# EAGLE schematic schematic_v1 (EAGLE 9.6.2)
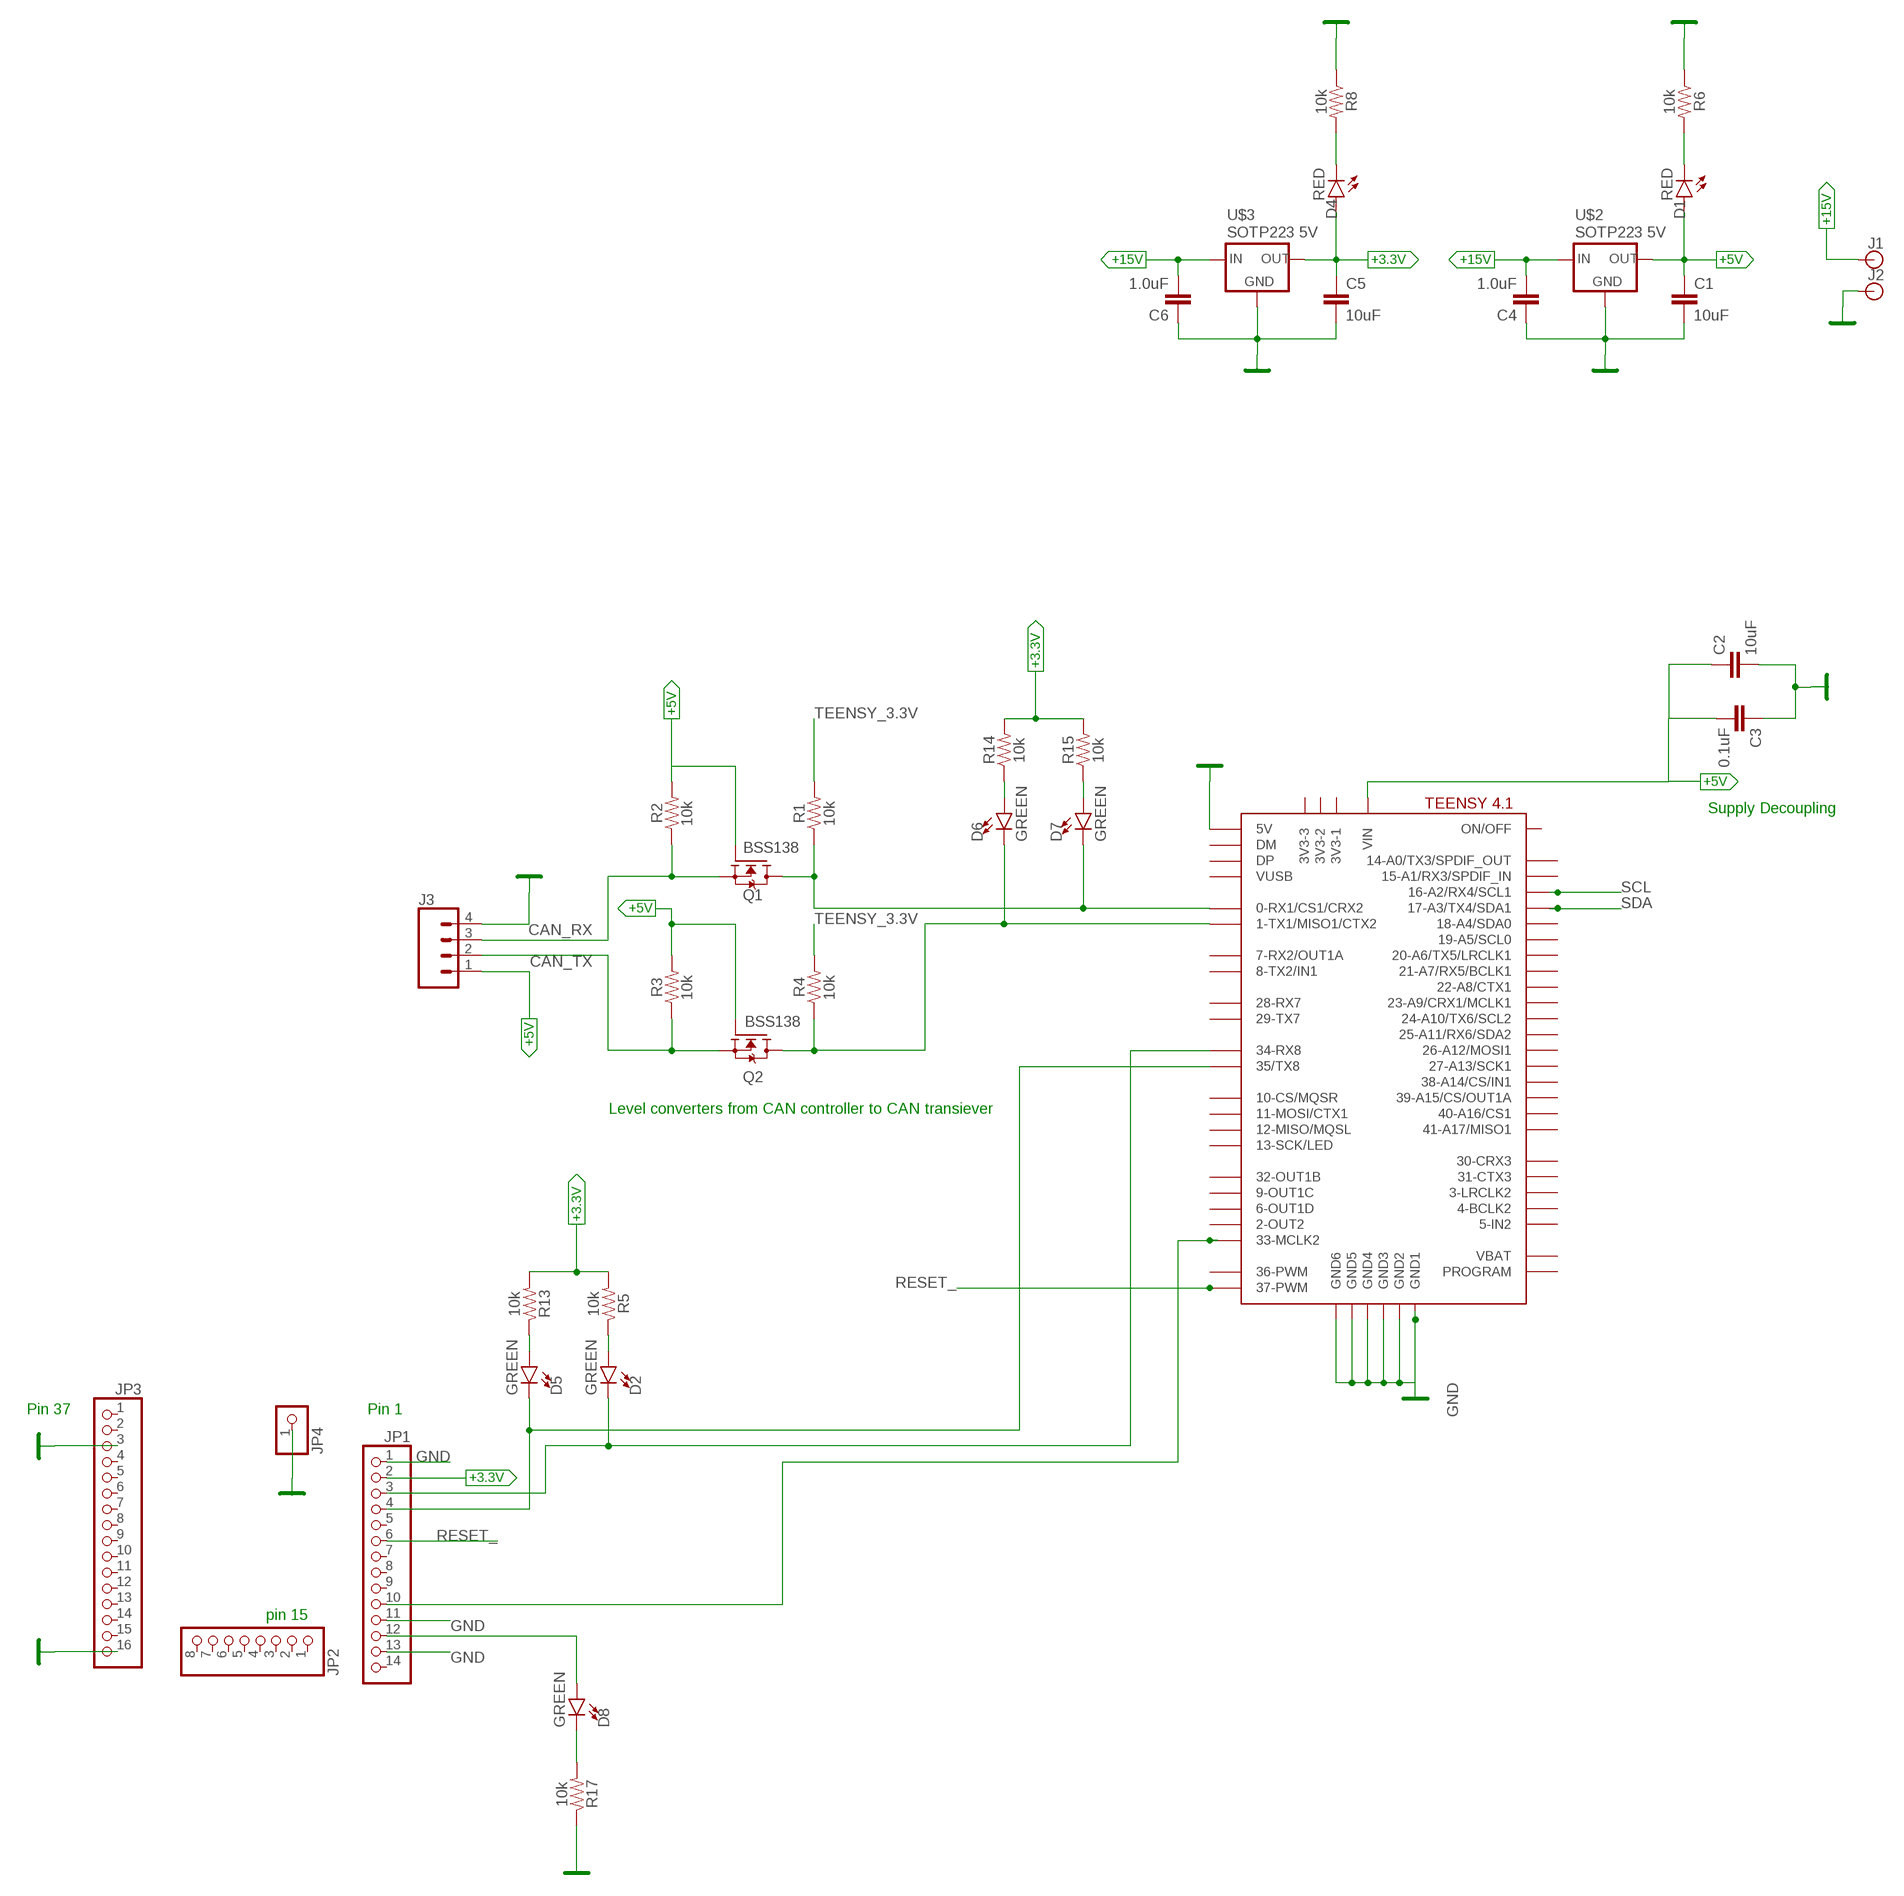
[diagram p0: schematic, sheet 1, part 1 of 2]
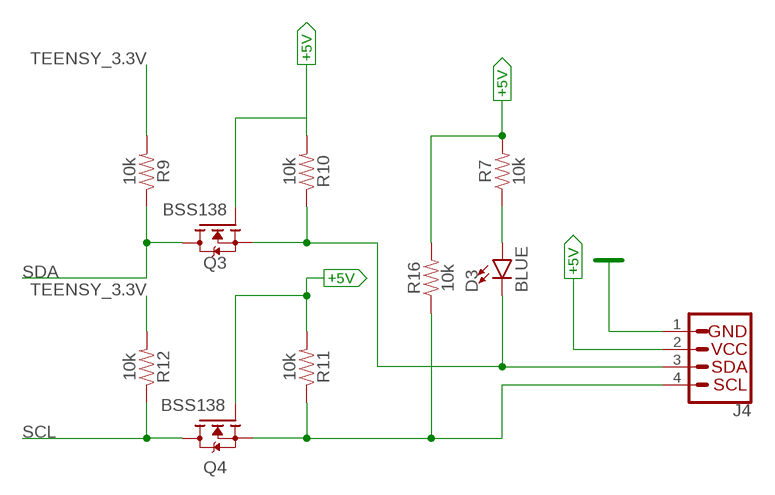
[diagram p1: schematic, sheet 1, part 2 of 2]

## Parts
C1  10uF  10UF-0603-6.3V-20%  [0603]
C2  10uF  10UF-0603-6.3V-20%  [0603]
C3  0.1uF  0.1UF-0603-25V-(+80/-20%)  [0603]
C4  1.0uF  1.0UF-0603-16V-10%  [0603]
C5  10uF  10UF-0603-6.3V-20%  [0603]
C6  1.0uF  1.0UF-0603-16V-10%  [0603]
D1  RED  LED-RED0603  [LED-0603]
D2  GREEN  LED-GREEN0603  [LED-0603]
D3  BLUE  LED-BLUE0603  [LED-0603]
D4  RED  LED-RED0603  [LED-0603]
D5  GREEN  LED-GREEN0603  [LED-0603]
D6  GREEN  LED-GREEN0603  [LED-0603]
D7  GREEN  LED-GREEN0603  [LED-0603]
D8  GREEN  LED-GREEN0603  [LED-0603]
J1  BANANA_CONN  [BANANA_CONN]
J2  BANANA_CONN  [BANANA_CONN]
J3  CONN_04PTH  [1X04]
J4  I2C_STANDARD  [1X04]
JP1  PINHD-1X14  [1X14]
JP2  PINHD-1X8  [1X08]
JP3  PINHD-1X16  [1X16]
JP4  PINHD-1X1  [1X01]
Q1  BSS138  [SOT95P240X111-3N]
Q2  BSS138  [SOT95P240X111-3N]
Q3  BSS138  [SOT95P240X111-3N]
Q4  BSS138  [SOT95P240X111-3N]
R1  10k  10KOHM-0603-1/10W-1%  [0603]
R2  10k  10KOHM-0603-1/10W-1%  [0603]
R3  10k  10KOHM-0603-1/10W-1%  [0603]
R4  10k  10KOHM-0603-1/10W-1%  [0603]
R5  10k  10KOHM-0603-1/10W-1%  [0603]
R6  10k  10KOHM-0603-1/10W-1%  [0603]
R7  10k  10KOHM-0603-1/10W-1%  [0603]
R8  10k  10KOHM-0603-1/10W-1%  [0603]
R9  10k  10KOHM-0603-1/10W-1%  [0603]
R10  10k  10KOHM-0603-1/10W-1%  [0603]
R11  10k  10KOHM-0603-1/10W-1%  [0603]
R12  10k  10KOHM-0603-1/10W-1%  [0603]
R13  10k  10KOHM-0603-1/10W-1%  [0603]
R14  10k  10KOHM-0603-1/10W-1%  [0603]
R15  10k  10KOHM-0603-1/10W-1%  [0603]
R16  10k  10KOHM-0603-1/10W-1%  [0603]
R17  10k  10KOHM-0603-1/10W-1%  [0603]
U$2  SOTP223 5V  V_REG_LD1117VXXLD1117-SMD  [SOT223]
U$3  SOTP223 5V  V_REG_LD1117VXXLD1117-SMD  [SOT223]
U$4  TEENSY41-E  [TENNSY41-E]

## Nets
+3.3V: C5.1 JP1.2 R5.2 R13.2 R14.2 R15.2 U$3.2(OUT)
+5V: C1.1 C2.1 C3.2 D1.A J3.1 J4.2 Q1.1(G) Q2.1(G) Q3.1(G) Q4.1(G) R2.2 R3.2 R7.2 R10.2 R11.2 R16.2 U$2.2(OUT) U$4.VIN
+5V1: D4.A
+15V: C4.2 C6.2 J1.P$1 U$2.3(IN) U$3.3(IN)
CAN_RX: J3.3 Q1.2(S) R2.1
CAN_RX1: D3.C J4.3 Q3.2(S) R10.1
CAN_TX: J3.2 Q2.2(S) R3.1
CAN_TX1: J4.4 Q4.2(S) R11.1 R16.1
GND: C1.2 C2.2 C3.1 C4.1 C5.2 C6.1 J2.P$1 J3.4 J4.1 JP1.1 JP1.11 JP1.13 JP3.3 JP3.16 JP4.1 R6.1 R8.1 R17.1 U$2.1(GND) U$3.1(GND) U$4.+5V(5V) U$4.GND1 U$4.GND2 U$4.GND3 U$4.GND4 U$4.GND5 U$4.GND6
N$1: D5.C JP1.4 U$4.35-TX8(35/TX8)
N$2: D2.C JP1.3 U$4.34-RX8
N$3: D8.A JP1.12
N$4: D3.A R7.1
N$5: D7.C Q1.3(D) R1.1 U$4.0-RX1/CS1/CRX2
N$6: D5.A R13.1
N$7: D1.C R6.2
N$8: D2.A R5.1
N$10: D4.C R8.2
N$11: D6.C Q2.3(D) R4.1 U$4.1-TX1/MISO1/CTX2
N$12: D8.C R17.2
N$13: D7.A R15.1
N$14: D6.A R14.1
N$15: U$4.37-PWM
RESET_: JP1.6 JP1.10 U$4.33-MCLK2
SCL: Q4.3(D) R12.1 U$4.16-A2/RX4/SCL1
SDA: Q3.3(D) R9.1 U$4.17-A3/TX4/SDA1
TEENSY_3.3V: R1.2 R4.2 R9.2 R12.2
Unconnected: JP1.5 JP1.7 JP1.8 JP1.9 JP1.14 JP2.1 JP2.2 JP2.3 JP2.4 JP2.5 JP2.6 JP2.7 JP2.8 JP3.1 JP3.2 JP3.4 JP3.5 JP3.6 JP3.7 JP3.8 JP3.9 JP3.10 JP3.11 JP3.12 JP3.13 JP3.14 JP3.15 U$4.2-OUT2 U$4.3-LRCLK2 U$4.3V3-1 U$4.3V3-2 U$4.3V3-3 U$4.4-BCLK2 U$4.5-IN2 U$4.6-OUT1D U$4.7-RX2/OUT1A U$4.8-TX2/IN1 U$4.9-OUT1C U$4.10-CS\MQSR(10-CS/MQSR) U$4.11-MOSI/CTX1 U$4.12-MISO/MQSL U$4.13-SCK/LED U$4.14-A0/TX3/SPDIF_OUT U$4.15-A1/RX3/SPDIF_IN U$4.18-A4/SDA0 U$4.19-A5/SCL0 U$4.20-A6/TX5/LRCLK1 U$4.21-A7/RX5/BCLK1 U$4.22-A8/CTX1 U$4.23-A9/CRX1/MCLK1 U$4.24-A10/TX6/SCL2 U$4.25-A11/RX6/SDA2 U$4.26-A12/MOSI1 U$4.27-A13/SCK1 U$4.28-RX7 U$4.29-TX7 U$4.30-CRX3 U$4.31-CTX3 U$4.32-OUT1B U$4.36-PWM U$4.38-A14/CS/IN1 U$4.39-A15/CS/OUT1A U$4.40-A16/CS1 U$4.41-A17/MISO1 U$4.DM U$4.DP U$4.ON/OFF U$4.PROGRAM U$4.VBAT U$4.VUSB

## Notes on the sheet
- Supply Decoupling
- Level converters from CAN controller to CAN transiever
- Pin 37 | Pin 1
- pin 15

## Library data of the parts
C1 C2 C5 = SparkFun-Capacitors:10UF: 10.0µF ceramic capacitors A capacitor is a passive two-terminal electrical component used to store electrical energy temporarily in an electric field.; PROD_ID: CAP-11015
C3 = SparkFun-Capacitors:0.1UF: 0.1µF ceramic capacitors A capacitor is a passive two-terminal electrical component used to store electrical energy temporarily in an electric field.; PROD_ID: CAP-00810
C4 C6 = SparkFun-Capacitors:1.0UF: 1µF ceramic capacitors A capacitor is a passive two-terminal electrical component used to store electrical energy temporarily in an electric field.; PROD_ID: CAP-00868
D1 D4 = SparkFun-LED:LED-RED: Red SMD LED Used in manufacturing of most products at SparkFun Packages: 0603 - SMD 0603 package [Product Link] <http://docs.avagotech.com/docs/AV02-0551EN> 0603 SMART - SMD 0603 SMART package ( more efficient and expensive)[Product Link] <http://www.osram-os.com/Graphics/XPic2/00077099_0.pdf> 1206 - SMD1206 package [Product Link] <https://www.sparkfun.com/datasheets/DevTools/LilyPad/Q150OVS4.pdff> SparkFun Products: Pro Mini 328 -5V <https://www.sparkfun.com/products/821> RedBoard <https://www.sparkfun.com/products/12757> IOIO-OTG <https://www.sparkfun.com/products/13613>; PROD_ID: DIO-00819
D2 D5-D8 = SparkFun-LED:LED-GREEN: Green SMD LED Used in manufacturing of various products at SparkFun Packages: 0603 - SMD 0603 package [Product Link] <http://www.futureelectronics.com/en/technologies/semiconductors/optoelectronics/leds/Pages/9894312-LTST-C190GKT.aspx?CrossPart=HSMG-C190&IM=0> LilyPad 1206 - SMD1206 LilyPad package [Product Link] <http://www.futureelectronics.com/en/Technologies/Product.aspx?ProductID=IN150NGHARVATEKCORPORATION2049943&IM=0> 1206 - SMD1206 package [Product Link] <http://www.futureelectronics.com/en/technologies/semiconductors/optoelectronics/leds/Pages/8315665-LTST-C150KGKT.aspx?IM=0> 1206 Bottom Mount -SMD 1206 Bottom Mount [Product Link] <http://www.digikey.com/product-detail/en/lite-on-inc/LTST-C230KGKT/160-1456-1-ND/386854> SparkFun Products: Pro Mini 328 -5V <https://www.sparkfun.com/products/821> RedBoard <https://www.sparkfun.com/products/12757> MP3 Trigger <https://www.sparkfun.com/products/13720> Makey Makey <https://www.sparkfun.com/products/11076>; PROD_ID: DIO-00821
D3 = SparkFun-LED:LED-BLUE: Blue SMD LED Used in manufacturing of various products at SparkFun Packages: 0603 - SMD 0603 package [Product Link] <http://www.digikey.com/product-detail/en/SMLE12BC7TT86/511-1589-2-ND/1641808> 1206 - SMD1206 package [Product Link] <http://www.digikey.com/product-detail/en/lite-on-inc/LTST-C150TBKT/160-1643-1-ND/573584> SparkFun Products: ESP8266 Thing-Dev Board <https://www.sparkfun.com/products/13711> RedBoard <https://www.sparkfun.com/products/12757>; PROD_ID: DIO-08575
J1 J2 = SparkFun-Connectors:BANANA_CONN: Through-hole Banana Jack Basic PTH connection for banana jack plugs SparkFun Products: Multimeter Kit <https://www.sparkfun.com/products/retired/10956> Banana to Alligator Cable <https://www.sparkfun.com/products/retired/509> Banana to Alligator Coax Cable <https://www.sparkfun.com/products/retired/508> Banana to Banana Cable <https://www.sparkfun.com/products/retired/507> Banana to IC Hook Cables <https://www.sparkfun.com/products/retired/506>
J3 = SparkFun-Connectors:CONN_04: Multi connection point. Often used as Generic Header-pin footprint for 0.1 inch spaced/style header connections On any of the 0.1 inch spaced packages, you can populate with these: Break Away Headers - Straight <https://www.sparkfun.com/products/116> (PRT-00116) Break Away Male Headers - Right Angle <https://www.sparkfun.com/products/553> (PRT-00553) Female Headers <https://www.sparkfun.com/products/115> (PRT-00115) Break Away Headers - Machine Pin <https://www.sparkfun.com/products/117> (PRT-00117) Break Away Female Headers - Swiss Machine Pin <https://www.sparkfun.com/products/743> (PRT-00743) For SCREWTERMINALS and SPRING TERMINALS visit here: Screw Terimnals on SparkFun.com <https://www.sparkfun.com/search/results?term=Screw+Terminals> (5mm/3.5mm/2.54mm spacing) This device is also useful as a general connection point to wire up your design to another part of your project. Our various solder wires solder well into these plated through hole pads. Hook-Up Wire - Assortment (Stranded, 22 AWG) <https://www.sparkfun.com/products/11375> (PRT-11375) Hook-Up Wire - Assortment (Solid Core, 22 AWG) <https://www.sparkfun.com/products/11367> (PRT-11367) View the entire wire category on our website here <https://www.sparkfun.com/categories/141> Special notes: Molex polarized connector foot print use with SKU : PRT-08231 with associated crimp pins and housings. 1MM SMD Version SKU: PRT-10208; PROD_ID: CONN-09696
J4 = SparkFun-Connectors:I2C_STANDARD: SparkFun I2C Standard Pinout Header SparkFun has standardized on a pinout for all I2C based sensor breakouts. This pinout allows I2C boards to be plugged directly into the headers on Arduino Uno compatible boards, and to be daisy chained easily. Example SparkFun Products: SparkFun Atmospheric Sensor Breakout - BME280 <https://www.sparkfun.com/products/13676> SparkFun Altitude/Pressure Sensor Breakout - MPL3115A2 <https://www.sparkfun.com/products/11084> SparkFun TOF Range Finder Sensor - VL6180 <https://www.sparkfun.com/products/12785>
JP1 = pinhead:PINHD-1X14: PIN HEADER
JP2 = pinhead:PINHD-1X8: PIN HEADER
JP3 = pinhead:PINHD-1X16: PIN HEADER
JP4 = pinhead:PINHD-1X1: PIN HEADER
Q1 Q2 = BSS138:BSS138: N-Channel 50V 220mA (Ta) 360mW (Ta) Surface Mount SOT-23-3 Check prices <https://pricing.snapeda.com/search/part/BSS138/?ref=eda>; AVAILABILITY: Good; DESCRIPTION: N-Channel 50V 220mA (Ta) 360mW (Ta) Surface Mount SOT-23-3; MF: ON Semiconductor; MP: BSS138; PACKAGE: SOT-23 ON Semiconductor; PRICE: None; PURCHASE-URL: https://pricing.snapeda.com/search/part/BSS138/?ref=eda
Q3 Q4 = BSS138:BSS138: N-Channel 50V 220mA (Ta) 360mW (Ta) Surface Mount SOT-23-3 Check prices <https://pricing.snapeda.com/search/part/BSS138/?ref=eda>; AVAILABILITY: Good; DESCRIPTION: N-Channel 50V 220mA (Ta) 360mW (Ta) Surface Mount SOT-23-3; MF: ON Semiconductor; MP: BSS138; PACKAGE: SOT-23 ON Semiconductor; PRICE: None; PURCHASE-URL: https://pricing.snapeda.com/search/part/BSS138/?ref=eda; SPICEPREFIX: Q
R1-R8 R13-R17 = SparkFun-Resistors:10KOHM: 10kΩ resistor A resistor is a passive two-terminal electrical component that implements electrical resistance as a circuit element. Resistors act to reduce current flow, and, at the same time, act to lower voltage levels within circuits. - Wikipedia; PROD_ID: RES-00824
R9-R12 = SparkFun-Resistors:10KOHM: 10kΩ resistor A resistor is a passive two-terminal electrical component that implements electrical resistance as a circuit element. Resistors act to reduce current flow, and, at the same time, act to lower voltage levels within circuits. - Wikipedia; PROD_ID: RES-00824; SPICEPREFIX: R
U$2 U$3 = SparkFun-IC-Power:V_REG_LD1117VXX: LD1117VXX voltage regulator. We carry the 3.3V version (COM-00526) in TO-220 package.; PROD_ID: VREG-13917
U$4 = teensy:TEENSY41-E